# EAGLE schematic schematic (EAGLE 7.4.0)
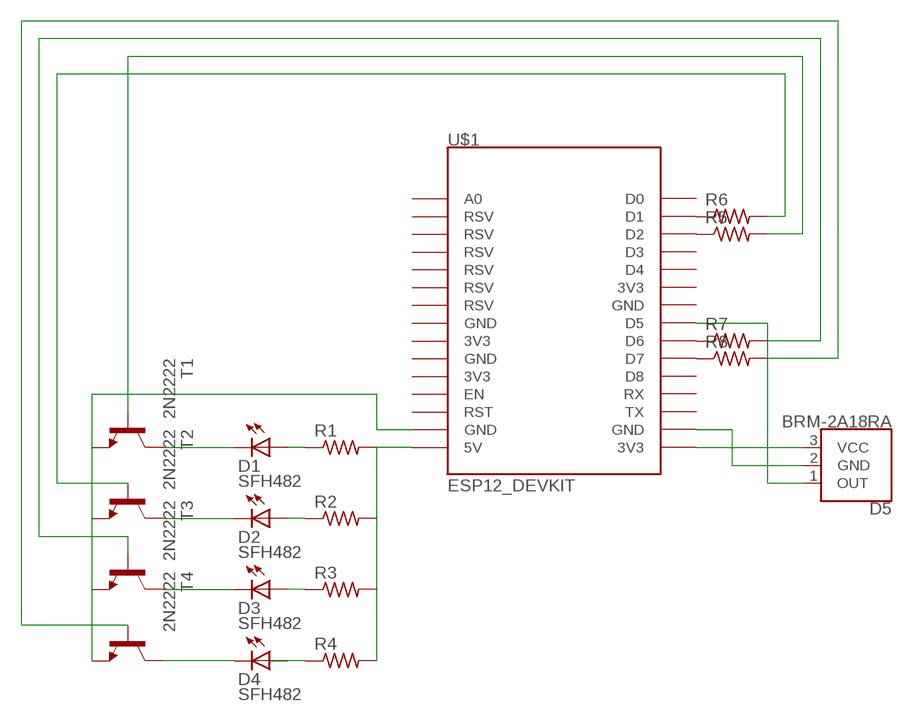
[diagram p0: schematic, sheet 1]

## Parts
D1  SFH482  [SFH482]
D2  SFH482  [SFH482]
D3  SFH482  [SFH482]
D4  SFH482  [SFH482]
D5  BRM-2A18RA  [BRM-2508]
R1  R-US_0207/10  [0207/10]
R2  R-US_0207/10  [0207/10]
R3  R-US_0207/10  [0207/10]
R4  R-US_0207/10  [0207/10]
R5  R-US_0207/10  [0207/10]
R6  R-US_0207/10  [0207/10]
R7  R-US_0207/10  [0207/10]
R8  R-US_0207/10  [0207/10]
T1  2N2222  [TO18]
T2  2N2222  [TO18]
T3  2N2222  [TO18]
T4  2N2222  [TO18]
U$1  ESP12_DEVKIT  [ESP12_DEVKIT]

## Nets
N$1: R1.2 R2.2 R3.2 R4.2 U$1.5V
N$2: D1.A R1.1
N$3: D2.A R2.1
N$4: D4.A R4.1
N$5: D1.K(C) T1.3(C)
N$6: D2.K(C) T2.3(C)
N$7: D3.K(C) T3.3(C)
N$8: D3.A R3.1
N$9: T1.1(E) T2.1(E) T3.1(E) T4.1(E) U$1.GND@1(GND)
N$10: R5.2 T1.2(B)
N$11: R6.2 T2.2(B)
N$12: R7.2 T3.2(B)
N$13: R8.2 T4.2(B)
N$14: D5.3(VCC) U$1.3V3@2(3V3)
N$15: D5.2(GND) U$1.GND@3(GND)
N$16: D5.1(OUT) U$1.D5
N$17: R5.1 U$1.D2
N$18: R6.1 U$1.D1
N$19: R7.1 U$1.D6
N$20: R8.1 U$1.D7
N$21: D4.K(C) T4.3(C)
Unconnected: U$1.3V3@0(3V3) U$1.3V3@1(3V3) U$1.3V3@3(3V3) U$1.A0 U$1.D0 U$1.D3 U$1.D4 U$1.D8 U$1.EN U$1.GND@0(GND) U$1.GND@2(GND) U$1.GND@4(GND) U$1.RST U$1.RSV@0(RSV) U$1.RSV@1(RSV) U$1.RSV@2(RSV) U$1.RSV@3(RSV) U$1.RSV@4(RSV) U$1.RSV@5(RSV) U$1.RX U$1.TX

## Library data of the parts
D1-D4 = led:SFH482: IR LED infrared emitting diode, Infineon
D5 = sparkfun-sensors:BRM-2A18: BRM-2A18 IR Receiver The BRM-2A18 is miniaturized infrared receiver for remote control and other applications requiring improved ambient light rejection. Vertical package is a primary component on the ZX Distance and Gesture Sensor. RA package is not currently in-use. Example Datasheet <http://www.sinoskysun.com/upload/20110512/201105120447164615.PDF> SparkFun Products ZX Distance and Gesture Sensor <https://www.sparkfun.com/products/12780> (COM-12780)
R1-R8 = resistor:R-US_: RESISTOR, American symbol
T1-T4 = transistor:2N2222: NPN TRANSISTOR
U$1 = esp12devkit:ESP12_DEVKIT: ESP12 DEVKIT BOARD

## Net classes
0 default: width 0.254 mm, clearance 0.254 mm